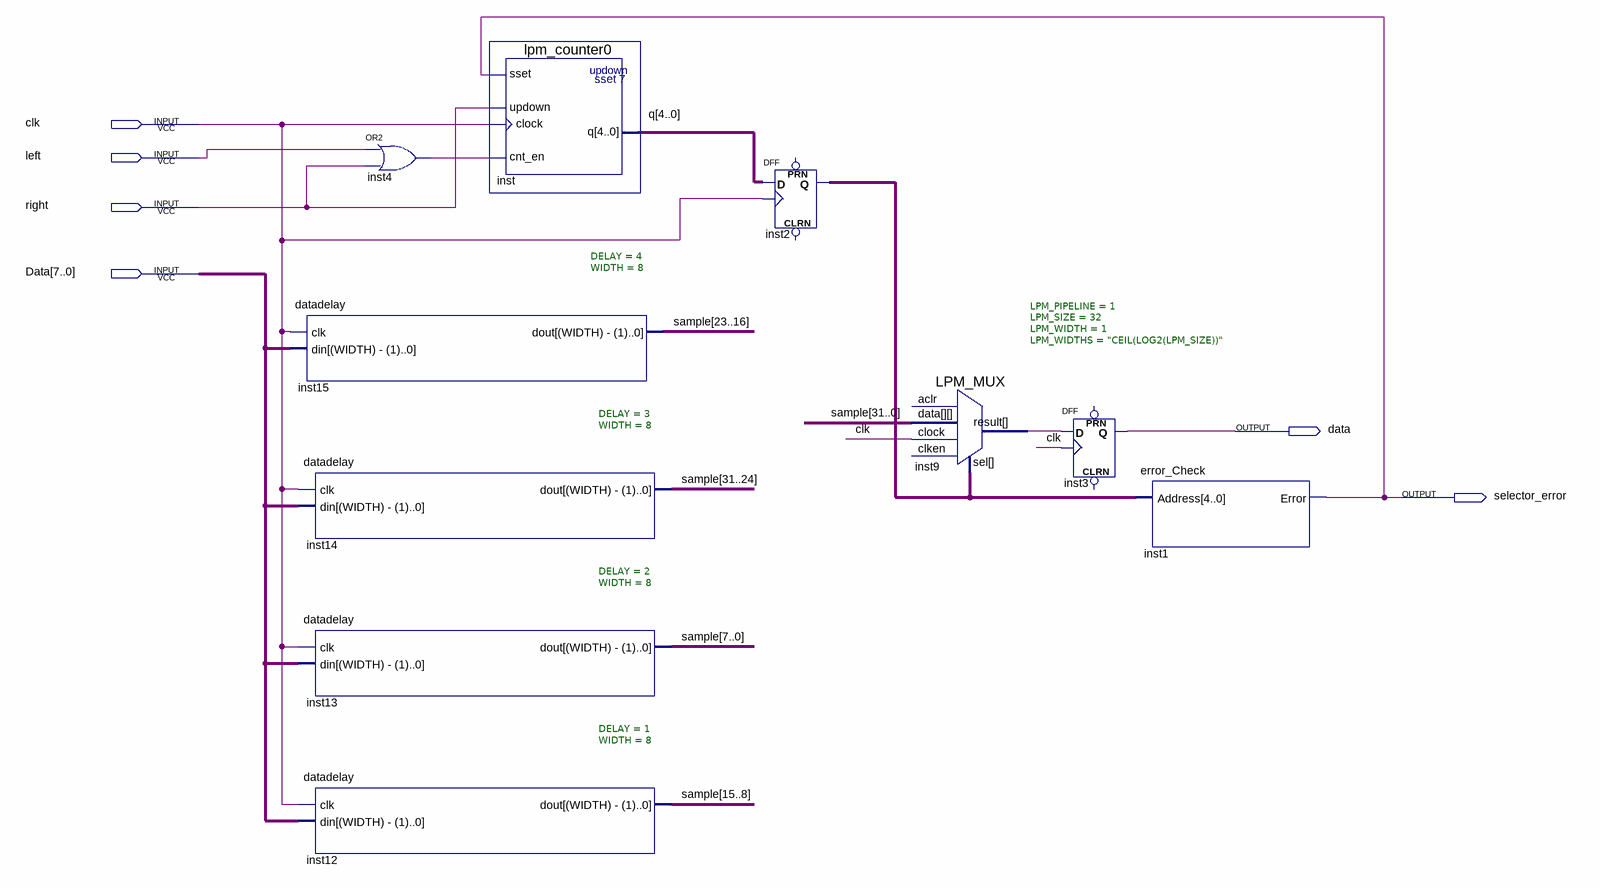
[diagram p0: schematic sheet]
// Quartus schematic Selector.bdf as structural Verilog: 10 symbols, 6 pins
module Selector (
  input  clk,
  input  left,
  input  right,
  input  [7:0] Data,
  output Data_1bit,
  output selector_error
);

  wire inst4_out, inst9_result;
  wire [4:0] inst2_q, q;
  wire [31:0] sample;

  datadelay #(.DELAY(4), .WIDTH(8)) inst15 (.clk(clk), .din(Data), .dout(sample[23:16]));
  datadelay #(.DELAY(3), .WIDTH(8)) inst14 (.clk(clk), .din(Data), .dout(sample[31:24]));
  datadelay #(.DELAY(2), .WIDTH(8)) inst13 (.clk(clk), .din(Data), .dout(sample[7:0]));
  datadelay #(.DELAY(1), .WIDTH(8)) inst12 (.clk(clk), .din(Data), .dout(sample[15:8]));
  or inst4 (inst4_out, left, right);
  lpm_counter0 inst (.sset(selector_error), .updown(right), .clock(clk), .cnt_en(inst4_out), .q(q));
  DFF inst2[4:0] (.CLK(clk), .D(q), .Q(inst2_q));  // open: CLRN, PRN
  LPM_MUX #(.LPM_PIPELINE(1), .LPM_SIZE(32), .LPM_WIDTH(1), .LPM_WIDTHS("CEIL(LOG2(LPM_SIZE))")) inst9 (
    .data(sample), .clock(clk), .sel(inst2_q), .result(inst9_result));  // open: aclr, clken
  DFF inst3 (.CLK(clk), .D(inst9_result), .Q(Data_1bit));  // open: CLRN, PRN
  error_Check inst1 (.Address(inst2_q), .Error(selector_error));
endmodule
